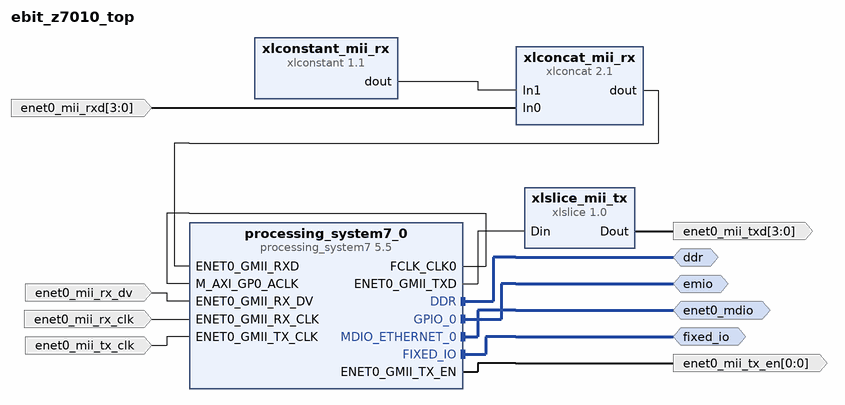
[diagram p0: block diagram of the top level]
# Vivado block design ebit_z7010_top, xc7z010clg400-1, Vivado 2018.3.1
create_bd_design ebit_z7010_top

create_bd_intf_port -mode Master -vlnv xilinx.com:interface:ddrx_rtl:1.0 ddr
create_bd_intf_port -mode Master -vlnv xilinx.com:display_processing_system7:fixedio_rtl:1.0 fixed_io
create_bd_intf_port -mode Master -vlnv xilinx.com:interface:mdio_rtl:1.0 enet0_mdio
create_bd_intf_port -mode Master -vlnv xilinx.com:interface:gpio_rtl:1.0 emio
create_bd_port -dir I enet0_mii_rx_dv
create_bd_port -dir I -type clk enet0_mii_rx_clk
create_bd_port -dir O -from 0 -to 0 enet0_mii_tx_en
create_bd_port -dir I -type clk enet0_mii_tx_clk
create_bd_port -dir O -from 3 -to 0 enet0_mii_txd
create_bd_port -dir I -from 3 -to 0 enet0_mii_rxd

create_bd_cell -type ip -vlnv xilinx.com:ip:processing_system7:5.5 processing_system7_0
set_property -dict [list \
  CONFIG.PCW_ENET0_ENET0_IO EMIO \
  CONFIG.PCW_ENET0_GRP_MDIO_ENABLE 1 \
  CONFIG.PCW_ENET0_GRP_MDIO_IO EMIO \
  CONFIG.PCW_ENET0_PERIPHERAL_ENABLE 1 \
  CONFIG.PCW_ENET0_PERIPHERAL_FREQMHZ {100 Mbps} \
  CONFIG.PCW_ENET_RESET_ENABLE 0 \
  CONFIG.PCW_GPIO_EMIO_GPIO_ENABLE 1 \
  CONFIG.PCW_GPIO_EMIO_GPIO_IO 2 \
  CONFIG.PCW_GPIO_EMIO_GPIO_WIDTH 2 \
  CONFIG.PCW_GPIO_MIO_GPIO_ENABLE 1 \
  CONFIG.PCW_GPIO_MIO_GPIO_IO MIO \
  CONFIG.PCW_I2C_RESET_ENABLE 0 \
  CONFIG.PCW_NAND_NAND_IO {MIO 0 2.. 14} \
  CONFIG.PCW_NAND_PERIPHERAL_ENABLE 1 \
  CONFIG.PCW_SD0_GRP_CD_ENABLE 0 \
  CONFIG.PCW_SD0_GRP_WP_ENABLE 0 \
  CONFIG.PCW_SD0_PERIPHERAL_ENABLE 1 \
  CONFIG.PCW_SD0_SD0_IO {MIO 40 .. 45} \
  CONFIG.PCW_SDIO_PERIPHERAL_FREQMHZ 100 \
  CONFIG.PCW_UART1_PERIPHERAL_ENABLE 1 \
  CONFIG.PCW_UART1_UART1_IO {MIO 24 .. 25} \
  CONFIG.PCW_UART_PERIPHERAL_FREQMHZ 100 \
  CONFIG.PCW_UIPARAM_DDR_BUS_WIDTH {16 Bit} \
  CONFIG.PCW_UIPARAM_DDR_PARTNO {MT41K128M16 JT-125} \
  CONFIG.PCW_USB_RESET_ENABLE 0 \
] [get_bd_cells processing_system7_0]
# 202 more settings of processing_system7_0 are not shown: defaults, MIO pin electricals, DDR timing, and values the tool derives
create_bd_cell -type ip -vlnv xilinx.com:ip:xlconcat:2.1 xlconcat_mii_rx
set_property -dict {CONFIG.IN0_WIDTH 4 CONFIG.IN1_WIDTH 4} [get_bd_cells xlconcat_mii_rx]
create_bd_cell -type ip -vlnv xilinx.com:ip:xlslice:1.0 xlslice_mii_tx
set_property -dict {CONFIG.DIN_FROM 3 CONFIG.DIN_TO 0 CONFIG.DIN_WIDTH 8 CONFIG.DOUT_WIDTH 4} [get_bd_cells xlslice_mii_tx]
create_bd_cell -type ip -vlnv xilinx.com:ip:xlconstant:1.1 xlconstant_mii_rx
set_property -dict {CONFIG.CONST_VAL 0 CONFIG.CONST_WIDTH 4} [get_bd_cells xlconstant_mii_rx]

# ---- connections ----

connect_bd_intf_net [get_bd_intf_ports fixed_io] [get_bd_intf_pins processing_system7_0/FIXED_IO]
connect_bd_intf_net [get_bd_intf_ports emio] [get_bd_intf_pins processing_system7_0/GPIO_0]
connect_bd_intf_net [get_bd_intf_ports ddr] [get_bd_intf_pins processing_system7_0/DDR]
connect_bd_intf_net [get_bd_intf_ports enet0_mdio] [get_bd_intf_pins processing_system7_0/MDIO_ETHERNET_0]
connect_bd_net [get_bd_pins processing_system7_0/FCLK_CLK0] [get_bd_pins processing_system7_0/M_AXI_GP0_ACLK]
connect_bd_net -net ENET0_GMII_RX_DV_0_1 [get_bd_ports enet0_mii_rx_dv] [get_bd_pins processing_system7_0/ENET0_GMII_RX_DV]
connect_bd_net -net ENET0_GMII_RX_CLK_0_1 [get_bd_ports enet0_mii_rx_clk] [get_bd_pins processing_system7_0/ENET0_GMII_RX_CLK]
connect_bd_net [get_bd_pins processing_system7_0/ENET0_GMII_TX_EN] [get_bd_ports enet0_mii_tx_en]
connect_bd_net -net ENET0_GMII_TX_CLK_0_1 [get_bd_ports enet0_mii_tx_clk] [get_bd_pins processing_system7_0/ENET0_GMII_TX_CLK]
connect_bd_net -net xlconcat_0_dout [get_bd_pins xlconcat_mii_rx/dout] [get_bd_pins processing_system7_0/ENET0_GMII_RXD]
connect_bd_net [get_bd_pins processing_system7_0/ENET0_GMII_TXD] [get_bd_pins xlslice_mii_tx/Din]
connect_bd_net -net xlslice_0_Dout [get_bd_pins xlslice_mii_tx/Dout] [get_bd_ports enet0_mii_txd]
connect_bd_net -net In0_0_1 [get_bd_ports enet0_mii_rxd] [get_bd_pins xlconcat_mii_rx/In0]
connect_bd_net -net xlconstant_0_dout [get_bd_pins xlconstant_mii_rx/dout] [get_bd_pins xlconcat_mii_rx/In1]

validate_bd_design
save_bd_design
